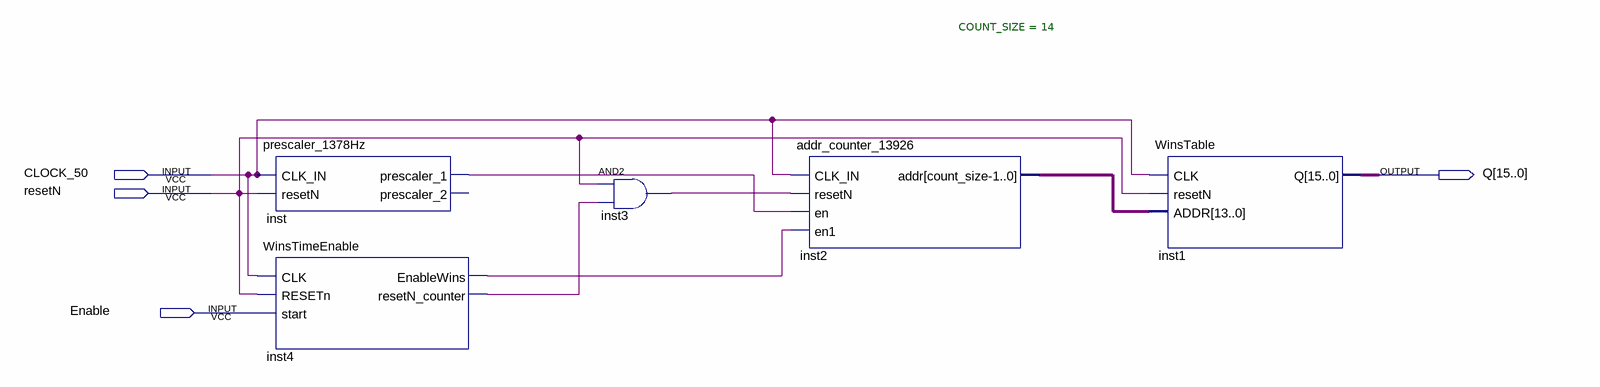
[diagram p0: schematic sheet]
// Quartus schematic WinsSound.bdf as structural Verilog: 5 symbols, 4 pins
module WinsSound (
  input  CLOCK_50,
  input  resetN,
  input  Enable,
  output [15:0] Q
);

  wire inst3_out, inst4_enablewins, inst4_resetn_counter, inst_prescaler_1;
  wire [13:0] inst2_addr;

  prescaler_1378Hz inst (.CLK_IN(CLOCK_50), .resetN(resetN), .prescaler_1(inst_prescaler_1));  // open: prescaler_2
  WinsTimeEnable inst4 (
    .CLK(CLOCK_50), .RESETn(resetN), .start(Enable), .EnableWins(inst4_enablewins),
    .resetN_counter(inst4_resetn_counter));
  and inst3 (inst3_out, resetN, inst4_resetn_counter);
  addr_counter_13926 #(.COUNT_SIZE(14)) inst2 (
    .CLK_IN(CLOCK_50), .resetN(inst3_out), .en(inst_prescaler_1), .en1(inst4_enablewins), .addr(inst2_addr));
  WinsTable inst1 (.CLK(CLOCK_50), .resetN(resetN), .ADDR(inst2_addr), .Q(Q));
endmodule
